# EasyEDA Pro project rtl_sdr_v1.eprj, board PCB3
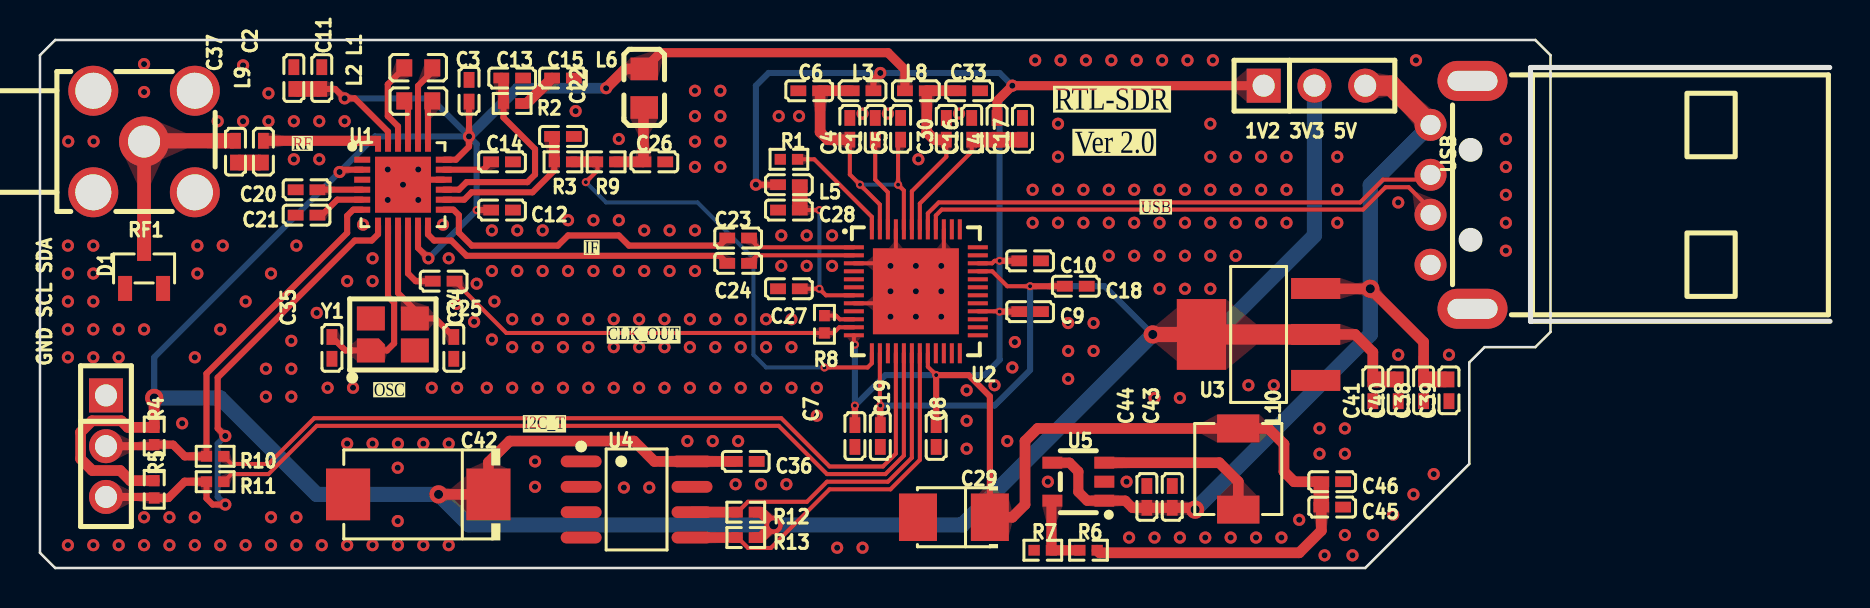
[diagram p7: board, top side]
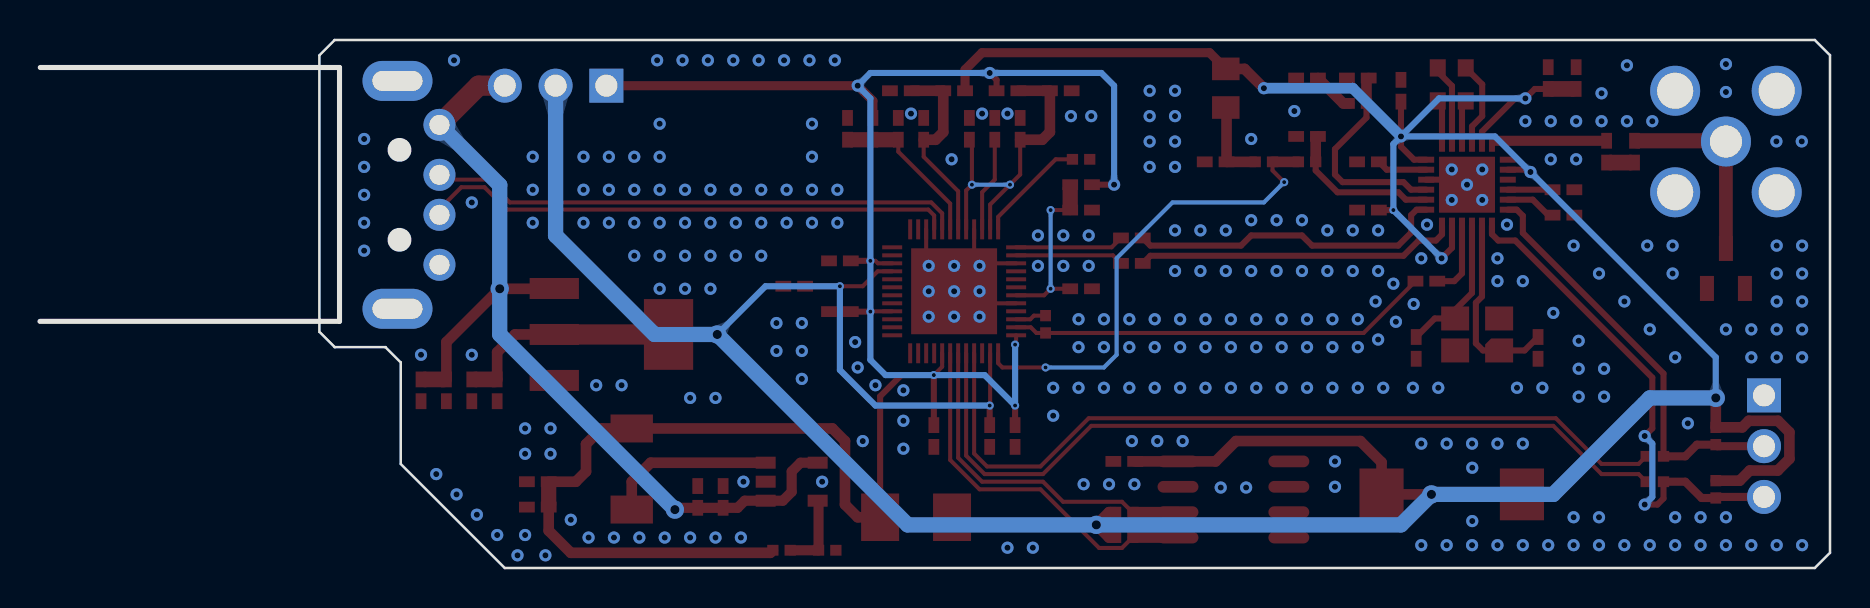
[diagram p8: board, bottom side, seen from below]

Outline 89.55 x 26.42 mm; copper layers: Top Layer, Bottom Layer. Coordinates in mm from the lower left corner of the outline.
Outline path: 0,25.65 0,0.76 0.76,0 66.29,0 71.5,5.21 71.5,10.29 72.26,11.05 74.8,11.05 75.57,11.81 75.57,25.65 74.8,26.42 0.76,26.42 0,25.65
Stack: Top Layer 0.035mm / Dielectric1 1.51mm FR4 er 4.5 / Bottom Layer 0.035mm

## Design rules (mm)
spacing safeClearance (default): track to track 0.152, other pairs 0.102 to 0.3
track width trackWidth (default): min 0.127, default 0.254, max 2.54
differential pair differentialPair (default): width min 0.127, default 0.254, max 2.54; gap min 0.152, default 0.152
via viaSize (default): diameter min 0.406, default 0.61, max 10; hole min 0.203, default 0.305, max 5.999

## Placement (name value [footprint] x y rotation side)
1V2 3V3 5V  A2541WV-3P  [HDR-TH_3P-P2.54-V-M]  63.75 24.13 0 top
C1  100nF  [C0402]  41.78 21.97 90 top
C2  100nF  [C0402]  12.7 24.51 90 top
C3  100nF  [C0402]  21.46 23.88 90 top
C4  100nF  [C0402]  40.51 21.97 270 top
C5  100nF  [C0402]  43.05 21.97 270 top
C6  2.2uF  [C0402]  38.48 23.88 0 top
C7  100nF  [C0402]  40.77 6.6 270 top
C8  100nF  [C0402]  44.83 6.6 270 top
C9  100nF  [C0402]  49.53 12.83 0 top
C10  100nF  [C0402]  49.53 15.37 0 top
C11  10nF  [C0402]  14.1 24.51 270 top
C12  10nF  [C0402]  23.11 17.91 180 top
C13  330pF  [C0402]  23.62 24.51 180 top
C14  100nF  [C0402]  23.11 20.32 180 top
C15  6.8nF  [C0402]  26.16 24.51 180 top
C16  100nF  [C0402]  46.61 21.97 270 top
C17  2.2uF  [C0402]  49.15 21.97 270 top
C18  100nF  [C0402]  51.82 14.1 0 top
C19  100nF  [C0402]  42.04 6.6 270 top
C20  1uF  [C0402]  13.33 18.92 0 top
C21  100nF  [C0402]  13.33 17.65 180 top
C22  100nF  [C0402]  26.16 21.59 0 top
C23  100nF  [C0402]  34.92 16.51 0 top
C24  100nF  [C0402]  34.92 15.24 0 top
C25  100nF  [C0402]  20.19 14.35 0 top
C26  100nF  [C0402]  30.73 20.32 180 top
C27  100nF  [C0402]  37.46 13.97 0 top
C28  2.2uF  [C0402]  37.46 17.91 0 top
C29  22uF  [CAP-SMD_L3.5-W2.8-FD]  45.72 2.54 180 top
C30  100nF  [C0402]  45.34 21.97 270 top
C33  2.2uF  [C0402]  46.48 23.88 180 top
C34  27pF  [C0402]  20.7 11.01 270 top
C35  27pF  [C0402]  14.61 11.01 90 top
C36  100nF  [C0402]  35.31 5.33 0 top
C37  10nF  [C0402]  9.78 20.83 270 top
C38  10uF  [C0402]  69.21 8.89 90 top
C39  100nF  [C0402]  70.48 8.89 90 top
C40  10uF  [C0402]  67.95 8.89 90 top
C41  100nF  [C0402]  66.67 8.89 90 top
C42  220uF  [CAP-SMD_L7.3-W4.3-R-RD]  18.92 3.68 0 top
C43  100nF  [C0402]  56.64 3.56 270 top
C44  10uF  [C0402]  55.37 3.56 270 top
C45  10uF  [C0402]  64.64 3.05 180 top
C46  100nF  [C0402]  64.64 4.32 180 top
D1  BAV99LT1G  [SOT-23-3_L2.9-W1.3-P1.90-LS2.4-BR]  5.21 14.99 270 top
GND SCL SDA  A2541WV-3P  [HDR-TH_3P-P2.54-V-M]  3.3 6.1 270 top
L1  150nH  [L0603]  18.92 25.02 0 top
L2  150nH  [L0603]  18.92 23.37 180 top
L3  26Ω@100MHz  [L0402]  41.15 23.88 0 top
L4  26Ω@100MHz  [L0402]  47.88 21.97 90 top
L5  26Ω@100MHz  [L0402]  37.46 19.18 180 top
L6  1.8uH  [L0805]  30.23 24 270 top
L8  26Ω@100MHz  [L0402]  43.82 23.88 180 top
L9  4.7nH  [L0402]  11.18 20.83 90 top
L10  2.2uH  [IND-SMD_L4.4-W4.2]  59.94 4.95 270 top
R1  10kΩ  [R0402]  37.46 20.45 0 top
R2  1.8kΩ  [R0402]  23.62 23.24 180 top
R3  10kΩ  [R0402]  26.16 20.32 0 top
R4  4.7kΩ  [R0402]  5.72 6.6 90 top
R5  4.7kΩ  [R0402]  5.72 3.94 90 top
R6  100kΩ  [R0402]  52.45 0.89 0 top
R7  100kΩ  [R0402]  50.17 0.89 0 top
R8  1MΩ  [R0402]  39.24 12.19 90 top
R9  1kΩ  [R0402]  28.32 20.32 0 top
R10  220Ω  [R0402]  8.76 5.59 0 top
R11  220Ω  [R0402]  8.76 4.32 0 top
R12  4.7kΩ  [R0402]  35.31 2.79 0 top
R13  4.7kΩ  [R0402]  35.31 1.52 0 top
RF1  DOSIN-806-0001  [CONN-TH_DOSIN-806-0001]  5.21 21.34 180 top
U1  -  [VQFN-24_L4.0-W4.0-P0.50-TL-EP2.8]  18.16 19.18 0 top
U2  -  [QFN-48_L6.0-W6.0-P0.40-BL-EP4.3]  43.82 13.84 270 top
U3  AMS1117-3.3  [SOT-223_L6.5-W3.5-P2.30-LS7.0-BR]  60.96 11.68 0 top
U4  M24C02-RMN6TP  [SOIC-8_L4.9-W3.9-P1.27-LS6.0-BL]  29.85 3.43 270 top
U5  SY8088AAC  [SOT-23-5_L3.0-W1.7-P0.95-LS2.8-BR]  51.94 4.32 0 top
USB  USB-05  [USB-A-TH_48037-0001]  70.61 18.67 90 top
Y1  -  [28.8MHz]  17.65 11.68 0 top

## Footprints (pads in the part's own frame, mm; a bottom-side part is the same pattern mirrored in y, then rotated)
28.8MHz
  custom 1.4x1.2 smd: 1(-1.1,-0.8)
  rect 1.4x1.2 smd: 2(1.1,-0.8) 3(1.1,0.8) 4(-1.1,0.8)
C0402
  rect 0.79x0.54 smd: 1(-0.545,0) 2(0.545,0)
CAP-SMD_L3.5-W2.8-FD
  rect 1.9x2.376 smd: 1(-1.798,0) 2(1.798,0)
CAP-SMD_L7.3-W4.3-R-RD
  rect 2.208x2.592 smd: 1(3.511,0) 2(-3.511,0)
CONN-TH_DOSIN-806-0001
  round 2.5 hole 1.8: 1(-2.54,-2.54) 2(-2.54,2.54) 3(2.54,2.54) 4(2.54,-2.54)
  round 2.5 hole 1.6: 5(0,0)
HDR-TH_3P-P2.54-V-M
  rect 1.7x1.7 hole 1.1: 1(-2.54,0)
  round 1.7 hole 1.1: 2(0,0) 3(2.54,0)
IND-SMD_L4.4-W4.2
  rect 1.4x2.12 smd: 1(2.028,0) 2(-2.028,0)
L0402
  rect 0.79x0.54 smd: 1(-0.545,0) 2(0.545,0)
L0603
  rect 0.8x0.864 smd: 1(-0.7,0) 2(0.7,0)
L0805
  rect 1.133x1.377 smd: 1(-0.966,0) 2(0.966,0)
QFN-48_L6.0-W6.0-P0.40-BL-EP4.3
  rect 0.2x1 smd: 1(-2.2,-3.1) 2(-1.8,-3.1) 3(-1.4,-3.1) 4(-1,-3.1) 5(-0.6,-3.1) 6(-0.2,-3.1) 7(0.2,-3.1) 8(0.6,-3.1) 9(1,-3.1) 10(1.4,-3.1) 11(1.8,-3.1) 12(2.2,-3.1) 25(2.2,3.1) 26(1.8,3.1) 27(1.4,3.1) 28(1,3.1) 29(0.6,3.1) 30(0.2,3.1) 31(-0.2,3.1) 32(-0.6,3.1) 33(-1,3.1) 34(-1.4,3.1) 35(-1.8,3.1) 36(-2.2,3.1)
  rect 1x0.2 smd: 13(3.1,-2.2) 14(3.1,-1.8) 15(3.1,-1.4) 16(3.1,-1) 17(3.1,-0.6) 18(3.1,-0.2) 19(3.1,0.2) 20(3.1,0.6) 21(3.1,1) 22(3.1,1.4) 23(3.1,1.8) 24(3.1,2.2) 37(-3.1,2.2) 38(-3.1,1.8) 39(-3.1,1.4) 40(-3.1,1) 41(-3.1,0.6) 42(-3.1,0.2) 43(-3.1,-0.2) 44(-3.1,-0.6) 45(-3.1,-1) 46(-3.1,-1.4) 47(-3.1,-1.8) 48(-3.1,-2.2)
  rect 4.3x4.3 smd: 49(-0.002,0.002)
R0402
  rect 0.566x0.54 smd: 1(-0.433,0) 2(0.433,0)
SOIC-8_L4.9-W3.9-P1.27-LS6.0-BL
  oval 0.588x2.045 smd: 1(-1.905,-2.772) 2(-0.635,-2.772) 3(0.635,-2.772) 4(1.905,-2.772) 5(1.905,2.772) 6(0.635,2.772) 7(-0.635,2.772) 8(-1.905,2.772)
SOT-23-3_L2.9-W1.3-P1.90-LS2.4-BR
  rect 1.25x0.7 smd: 1(1,-0.95) 2(1,0.95) 3(-1,0)
SOT-23-5_L3.0-W1.7-P0.95-LS2.8-BR
  rect 1x0.6 smd: 1(1.3,-0.95) 2(1.3,0) 3(1.3,0.95) 4(-1.3,0.95) 5(-1.3,-0.95)
SOT-223_L6.5-W3.5-P2.30-LS7.0-BR
  rect 2.465x1.05 smd: 1(2.857,-2.3) 2(2.857,0) 3(2.857,2.3)
  rect 2.465x3.54 smd: 4(-2.857,0)
USB-A-TH_48037-0001
  round 1.6 hole 1: 1(3.5,1.05) 2(1,1.05) 3(-1,1.05) 4(-3.5,1.05)
  oval 2x3.5 hole 1x2.5: 5(-5.7,-1.05) 6(5.7,-1.05)
VQFN-24_L4.0-W4.0-P0.50-TL-EP2.8
  rect 0.8x0.3 smd: 1(-2.042,1.25) 2(-2.042,0.75) 3(-2.042,0.25) 4(-2.042,-0.25) 5(-2.042,-0.75) 6(-2.042,-1.25) 13(2.042,-1.25) 14(2.042,-0.75) 15(2.042,-0.25) 16(2.042,0.25) 17(2.042,0.75) 18(2.042,1.25)
  rect 0.3x0.8 smd: 7(-1.25,-2.048) 8(-0.75,-2.048) 9(-0.25,-2.048) 10(0.249,-2.048) 11(0.75,-2.048) 12(1.25,-2.048) 19(1.25,2.048) 20(0.75,2.048) 21(0.249,2.048) 22(-0.25,2.048) 23(-0.75,2.048) 24(-1.25,2.048)
  rect 2.8x2.8 smd: 25(-0.001,-0.001)

## Nets
As in the schematic, except:
1V2: 1V2 3V3 5V.1 C7.1 C8.1 C9.1 C10.1 C29.1 C45.2 C46.2 L3.2 L4.2 L5.2 L10.2 R6.2 U2.12 U2.20 U2.28 U2.34
3V3: 1V2 3V3 5V.2 C2.1 C3.1 C11.2 C12.2 C18.1 C19.1 C36.1 C40.2 C41.2 C42.1 L6.1 L8.2 R4.2 R5.2 R12.2 R13.2 U1.2 U1.11 U1.18 U1.23 U2.14 U2.33 U3.2 U3.4 U4.8
5V: 1V2 3V3 5V.3 C38.2 C39.2 C43.2 C44.2 U3.3 U5.1 U5.4 USB.1
GND: C1.2 C2.2 C3.2 C4.1 C5.1 C6.1 C7.2 C8.2 C9.2 C10.2 C11.1 C12.1 C13.1 C14.1 C15.1 C16.1 C17.1 C18.2 C19.2 C20.1 C21.2 C22.2 C26.1 C27.1 C28.1 C29.2 C30.1 C33.1 C34.2 C35.1 C36.2 C38.1 C39.1 C40.1 C41.1 C42.2 C43.1 C44.1 C45.1 C46.1 D1.1 D1.2 GND SCL SDA.1 R1.1 R7.1 RF1.1 RF1.2 RF1.3 RF1.4 U1.16 U1.25 U2.3 U2.8 U2.39 U2.45 U2.49 U3.1 U4.1 U4.2 U4.3 U4.4 U4.7 U5.2 USB.4 Y1.2 Y1.4
T_SCL: GND SCL SDA.2 R4.1 R10.1 U1.6
T_SDA: GND SCL SDA.3 R5.1 R11.1 U1.7

Pads without a net: U1 1 3; U2 4 5 6 9 15 21 22 23 24 25 26 27 29 30 31 32 35 36 37 38; USB 5 6

## Via types
v1: diameter 0.61, hole 0.305, Top Layer to Bottom Layer, 295 vias
v2: diameter 0.914, hole 0.457, Top Layer to Bottom Layer, 6 vias
v3: diameter 0.406, hole 0.203, Top Layer to Bottom Layer, 14 vias

## Routing (per net, layer and track width the routed paths; a pad name or vN(x,y) marks a point on that pad's centre or on a via; arc(x,y) is an arc through that point)
1V2: length 114.8
  Top Layer w0.203: v3(48.01,15.37) 47.75,15.37 47.63,15.24 46.92,15.24 ; 44.42,10.74 44.42,10.07 v3(44.83,9.65) ; v3(40.77,11.18) 40.71,11.23 U2.12 ; U2.28 47.99,12.84 v3(48.01,12.83)
  Top Layer w0.305: L5.2 v1(35.81,19.18) ; v1(42.04,24.77) 41.69,24.42 L3.2 ; C7.1 v3(40.77,8.13) ; v3(48.01,15.37) C10.1 ; C8.1 v3(44.83,9.65) 46.45,9.65 47.52,8.59 C29.1 ; v3(48.01,12.83) C9.1
  Top Layer w0.457: L4.2 47.88,23.37 v1(48.64,24.13) 1V2 3V3 5V.1
  Top Layer w0.533: R6.2 53.01,0.76 62.99,0.76 64.1,1.87 C45.2 ; C29.1 48.64,2.54 49.28,3.17 49.28,6.35 49.91,6.98 L10.2 61.45,6.98 62.23,6.2 62.23,4.83 62.74,4.32 C46.2
  Top Layer w0.762: 64.1,3.17 64.1,4.1
  Bottom Layer w0.305: v1(35.81,19.18) 35.81,24.13 36.45,24.77 v1(42.04,24.77) 48.01,24.77 v1(48.64,24.13) 48.01,23.5 v3(48.01,15.37) v3(48.01,12.83) 48.01,10.41 47.24,9.65 v3(44.83,9.65) 42.29,9.65 v3(40.77,8.13) v3(40.77,11.18)
3V3: length 221.3
  Top Layer w0.203: 42.02,10.74 42.02,8.15 v3(42.04,8.13) ; U2.33 47.64,14.84 48.39,14.1 v3(49.53,14.1)
  Top Layer w0.305: v1(14.99,19.81) 15.1,19.93 U1.2 ; 18.91,17.13 18.91,16.01 v1(19.43,15.49) ; C3.1 v1(21.46,21.59) 21.46,21.08 20.81,20.43 U1.18 ; v3(49.53,14.1) C18.1 ; v3(42.04,8.13) C19.1 ; C11.2 14.77,23.97 v1(15.24,23.5) 15.75,23.5 17.41,21.83 U1.23 ; v3(21.84,17.91) C12.2
  Top Layer w0.457: L8.2 43.27,24.93 42.42,25.78 31.04,25.78 L6.1
  Top Layer w0.533: U3.2 65.79,11.68 66.67,10.8 C41.2 ; v2(5.72,8.51) R4.2 4.39,7.04 4.06,7.37 2.6,7.37 2.03,6.79 2.03,5.46 2.61,4.88 4.01,4.88 4.52,4.37 R5.2 ; L6.1 29.29,24.97 v1(28.32,24) ; R12.2 36.07,2.79 v2(36.7,2.16) 36.07,1.52 R13.2 ; v2(19.94,3.68) C42.1 22.43,5.29 23.5,6.35 29.72,6.35 30.73,5.33 U4.8 C36.1
  Top Layer w0.762: v2(55.67,11.68) U3.4
  Top Layer w0.787: 12.92,23.97 13.88,23.97 ; 66.8,9.44 67.73,9.44
  Top Layer w1.016: U3.2 U3.4
  Bottom Layer w0.305: v2(55.67,11.68) 53.25,14.1 v3(49.53,14.1) 49.53,9.91 47.75,8.13 v3(42.04,8.13) ; v1(19.43,15.49) v3(21.84,17.91) 21.84,21.21 v1(21.46,21.59) ; v1(21.46,21.59) 16.76,21.59 v1(14.99,19.81) 5.72,10.54 v2(5.72,8.51) ; v1(21.46,21.59) 19.56,23.5 v1(15.24,23.5)
  Bottom Layer w0.533: v1(28.32,24) 23.88,24 v1(21.46,21.59)
  Bottom Layer w0.762: 1V2 3V3 5V.2 63.75,16.64 58.8,11.68 v2(55.67,11.68) 46.14,2.16 v2(36.7,2.16) 21.46,2.16 v2(19.94,3.68) 13.84,3.68 9.02,8.51 v2(5.72,8.51)
5V: length 46.2
  Top Layer w0.508: v2(57.79,2.92) 57.7,3.01 C43.2 C44.2 54.65,3.01 54.29,3.37 U5.1 52.39,3.37 51.94,3.81 51.94,4.83 51.5,5.27 U5.4
  Top Layer w0.533: C38.2 69.21,11.3 v2(66.55,13.97) 63.83,13.97 U3.3
  Top Layer w0.787: 69.34,9.44 70.27,9.44
  Top Layer w1.016: 1V2 3V3 5V.3 67.6,24.13 USB.1
  Bottom Layer w0.762: v2(57.79,2.92) 66.55,11.68 v2(66.55,13.97) 66.55,19.16 USB.1
GND: length 9.9
  Top Layer w0.203: v1(42.55,13.84) 41.95,13.24 40.71,13.24 ; v1(45.09,15.11) 45.21,15.24 U2.39 ; U2.45 42.82,15.38 v1(42.55,15.11) 42.42,15.24 40.71,15.24
  Top Layer w0.305: U1.16 18.41,19.43 v1(18.16,19.18)
  vias: v1(1.41,21.34) v1(1.4,16.13) v1(1.4,14.73) v1(1.4,13.33) v1(1.4,11.94) v1(1.4,10.54) v1(1.4,1.14) v1(2.68,21.34) v1(2.67,16.13) v1(2.67,14.73) v1(2.67,13.33) v1(2.67,11.94) v1(2.67,10.54) v1(2.67,1.14) v1(3.94,11.94) v1(3.94,10.54) v1(3.94,1.14) v1(5.21,25.21) v1(5.21,23.81) v1(5.21,11.94) v1(5.21,2.54) v1(5.21,1.14) v1(6.48,2.54) v1(6.48,1.14) v1(7.11,7.24) v1(7.75,10.54) v1(7.75,2.54) v1(7.75,1.14) v1(7.87,16.13) v1(7.87,14.73) v1(8.89,22.35) v1(9.02,11.94) v1(9.02,1.14) v1(9.14,16.13) v1(10.16,25.15) v1(10.16,22.35) v1(10.29,13.33) v1(10.29,1.14) v1(11.3,9.97) v1(11.3,8.57) v1(11.43,23.75) v1(11.43,22.35) v1(11.56,14.73) v1(11.56,2.54) v1(11.56,1.14) v1(12.57,11.37) v1(12.57,9.97) v1(12.57,8.57) v1(12.7,22.35) v1(12.7,20.45) v1(12.83,16.13) v1(12.83,2.54) v1(12.83,1.14) v1(13.84,12.76) v1(13.97,22.35) v1(13.97,20.45) v1(14.1,1.14) v1(14.39,9.02) v1(15.24,22.35) v1(15.37,14.35) v1(15.37,6.22) v1(15.37,1.14) v1(15.66,9.02) v1(16.16,17.18) v1(16.64,15.49) v1(16.64,14.35) v1(16.64,6.22) v1(16.64,1.14) v1(17.4,19.94) v1(17.4,18.41) v1(17.91,6.22) v1(17.9,5.02) v1(17.9,2.35) v1(17.91,1.14) v1(18.92,19.94) v1(18.92,18.41) v1(19.18,6.22) v1(19.18,1.14) v1(19.6,9.02) v1(20.16,17.18) v1(20.45,15.49) v1(20.45,6.22) v1(20.45,1.14) v1(20.83,13.21) v1(20.87,9.02) v1(21.72,12.32) v1(21.84,14.22) v1(22.35,9.02) v1(22.61,16.89) v1(22.61,14.86) v1(22.61,11.43) v1(22.73,13.33) v1(23.62,12.45) v1(23.62,11.05) v1(23.62,9.02) v1(23.88,16.89) v1(23.88,14.86) v1(24.77,5.33) v1(24.77,4.06) v1(24.89,12.45) v1(24.89,11.05) v1(24.89,9.02) v1(25.15,16.89) v1(25.15,14.86) v1(26.16,12.45) v1(26.16,11.05) v1(26.16,9.02) v1(26.42,17.4) v1(26.42,14.86) v1(26.8,22.86) v1(27.43,12.45) v1(27.43,11.05) v1(27.43,9.02) v1(27.69,17.4) v1(27.69,14.86) v1(28.7,12.45) v1(28.7,11.05) v1(28.7,9.02) v1(28.96,21.46) v1(28.96,17.4) v1(28.96,14.86) v1(29.21,4.03) v1(29.97,12.45) v1(29.97,11.05) v1(29.97,9.02) v1(30.23,16.89) v1(30.23,14.86) v1(30.48,4.03) v1(31.24,12.45) v1(31.24,11.05) v1(31.24,9.02) v1(31.5,16.89) v1(31.5,14.86) v1(32.39,6.35) v1(32.51,12.45) v1(32.51,11.05) v1(32.51,9.02) v1(32.77,23.88) v1(32.77,22.61) v1(32.77,21.34) v1(32.77,20.07) v1(32.77,16.89) v1(32.77,14.86) v1(33.65,6.35) v1(33.78,12.45) v1(33.78,11.05) v1(33.78,9.02) v1(34.04,23.88) v1(34.04,22.61) v1(34.04,21.34) v1(34.04,20.07) v1(34.8,4.19) v1(34.92,6.35) v1(35.05,12.45) v1(35.05,11.05) v1(35.05,9.02) v1(36.07,4.19) v1(36.32,12.45) v1(36.32,11.05) v1(36.32,9.02) v1(36.96,22.61) v1(37.08,16.64) v1(37.08,15.11) v1(37.34,4.19) v1(37.59,12.45) v1(37.59,11.05) v1(37.59,9.02) v1(37.97,22.61) v1(38.35,16.64) v1(38.35,15.11) v1(38.86,9.02) v1(38.86,7.62) v1(39.62,16.64) v1(39.62,15.11) v1(39.88,1.02) v1(41.15,22.73) v1(41.15,1.02) v1(42.42,22.73) v1(42.55,12.57) v1(43.82,15.11) v1(43.82,13.84) v1(43.82,12.57) v1(43.94,20.45) v1(45.09,13.84) v1(45.09,12.57) v1(45.97,22.73) v1(46.36,8.89) v1(46.36,7.37) v1(46.36,5.97) v1(47.75,9.14) v1(48.39,6.35) v1(48.64,10.03) v1(48.77,11.3) v1(49.66,18.92) v1(49.66,17.27) v1(49.78,25.4) v1(50.42,4.32) v1(50.93,22.22) v1(50.93,20.57) v1(50.93,18.92) v1(50.93,17.27) v1(51.05,25.4) v1(51.43,12.26) v1(51.43,10.86) v1(51.43,9.46) v1(52.2,18.92) v1(52.2,17.27) v1(52.32,25.4) v1(52.7,12.26) v1(52.7,10.86) v1(53.47,18.92) v1(53.47,17.27) v1(53.47,15.62) v1(53.59,25.4) v1(54.36,4.32) v1(54.48,1.52) v1(54.74,18.92) v1(54.74,17.27) v1(54.74,15.62) v1(54.86,25.4) v1(55.75,8.51) v1(55.75,1.52) v1(56.01,18.92) v1(56.01,17.27) v1(56.01,15.62) v1(56.01,13.97) v1(56.13,25.4) v1(57.02,8.51) v1(57.02,1.52) v1(57.28,18.92) v1(57.28,17.27) v1(57.28,15.62) v1(57.28,13.97) v1(57.4,25.4) v1(58.29,1.52) v1(58.55,22.22) v1(58.55,20.57) v1(58.55,18.92) v1(58.55,17.27) v1(58.55,15.62) v1(58.55,13.97) v1(58.67,25.4) v1(59.56,1.52) v1(59.82,20.57) v1(59.82,18.92) v1(59.82,17.27) v1(59.82,15.62) v1(60.45,9.14) v1(60.83,1.52) v1(61.09,20.57) v1(61.09,18.92) v1(61.09,17.27) v1(61.72,9.14) v1(62.1,1.52) v1(62.36,20.57) v1(62.36,18.92) v1(62.36,17.27) v1(62.99,2.41) v1(64.01,6.98) v1(64.01,5.72) v1(64.26,0.64) v1(64.9,20.57) v1(64.9,18.92) v1(64.9,17.27) v1(65.28,6.98) v1(65.28,5.72) v1(65.28,1.65) v1(65.66,0.64) v1(66.67,1.65) v1(67.69,2.67) v1(67.95,18.29) v1(67.95,10.67) v1(68.71,3.68) v1(68.83,25.4) v1(69.72,4.7) v1(70.48,10.67) v1(73.33,21.46) v1(73.33,20.07) v1(73.33,18.67) v1(73.33,17.27) v1(73.33,15.88)
VDD_PLL: length 8.7
  Top Layer w0.203: 38.01,17.91 v3(38.99,17.91) ; U2.7 39.32,13.64 v3(38.99,13.97) 38.01,13.97
  Top Layer w0.762: 38.01,18.03 38.01,18.96
  Bottom Layer w0.203: v3(38.99,17.91) v3(38.99,13.97)
VDDA12: length 17
  Top Layer w0.203: C4.2 40.51,19.69 v3(41.02,19.18) 42.02,18.18 U2.47 ; U2.44 43.21,18.89 v3(42.93,19.18) 42.93,21.3 C5.2
  Top Layer w0.533: L3.1 C6.2 39.03,21.81 39.41,21.43 C4.2
  Bottom Layer w0.203: v3(41.02,19.18) v3(42.93,19.18)
VDDA33: length 10
  Top Layer w0.203: U2.43 43.61,18.85 45.34,20.57 C30.2
  Top Layer w0.533: C30.2 44.74,21.43 44.36,21.81 L8.1 C33.2
CLK_OUT: length 21.2
  Top Layer w0.203: 40.71,12.04 39.98,12.04 39.7,11.76 R8.1 23.33,11.76 C25.2
IF_AGC: length 24.1
  Top Layer w0.203: 27.89,20.32 27.89,19.89 v3(27.3,19.3) ; 41.61,10.74 41.61,10.25 41.4,10.03 v3(39.24,10.03)
  Top Layer w0.533: R3.2 27.89,20.32
  Bottom Layer w0.203: v3(27.3,19.3) 28.32,18.29 32.89,18.29 35.69,15.49 35.69,10.67 36.32,10.03 v3(39.24,10.03)
IF_IN: length 5.4
  Top Layer w0.203: U2.2 35.87,15.64 35.47,15.24
IF_IP: length 5.4
  Top Layer w0.203: 35.47,16.51 35.94,16.04 40.71,16.04
RF_IN: length 5.6
  Top Layer w0.508: L9.2 16.73,21.37
ROM_SCL: length 17.3
  Top Layer w0.203: 34.9,2.79 35.42,3.31 38.37,3.31 39.37,4.32 42.42,4.32 43.61,5.52 43.61,10.74
  Top Layer w0.533: R12.1 U4.6
ROM_SDA: length 18.7
  Top Layer w0.203: 44.01,10.74 44.01,5.41 42.55,3.94 39.5,3.94 36.56,1 35.42,1 34.9,1.52
  Top Layer w0.533: R13.1 U4.5
T_SCL: length 21.1
  Top Layer w0.305: R10.1 8.33,9.73 15.37,16.76 15.37,17.62 15.67,17.93 U1.6
  Top Layer w0.406: R10.1 7.24,5.59 6.66,6.17 R4.1 5.64,6.1 GND SCL SDA.2
T_SDA: length 25.5
  Top Layer w0.305: 16.91,17.13 16.91,16.7 16.6,16.38 15.75,16.38 8.89,9.53 8.89,6.98 v1(9.27,6.6) ; R11.1 8.33,3.48 8.64,3.17 v1(9.27,3.17)
  Top Layer w0.406: GND SCL SDA.3 5.66,3.56 R5.1 6.42,3.5 7.24,4.32 R11.1
  Bottom Layer w0.305: v1(9.27,3.17) 8.89,3.56 8.89,6.22 v1(9.27,6.6)
USB_DM: length 26.7
  Top Layer w0.203: U2.41 44.42,17.75 44.96,18.29 66.04,18.29 67.18,19.43 69.32,19.43 USB.2
USB_DP: length 26.8
  Top Layer w0.203: U2.40 44.81,17.64 45.11,17.93 66.19,17.93 67.31,19.05 68.47,19.05 69.56,17.96 USB.3
UVDDA: length 7.2
  Top Layer w0.203: C16.2 46.61,20.83 44.01,18.23 U2.42
  Top Layer w0.762: 48.13,21.43 48.93,21.43 ; 46.86,21.43 47.66,21.43
XTAL_I: length 9.6
  Top Layer w0.305: 17.41,17.13 17.41,13.58 17.72,13.27 17.72,11.24 17.36,10.88 Y1.1 15.28,10.88 C35.2
XTAL_O: length 7.3
  Top Layer w0.305: C34.1 19.77,12.48 Y1.3 18.75,12.91 17.91,13.76 17.91,17.13
$1N1594: length 9.8
  Top Layer w0.686: RF1.5 D1.3
  Top Layer w0.762: 9.61,21.37 5.24,21.37 RF1.5
$1N1930: length 1
  Top Layer w0.787: 10,20.28 10.96,20.28
$1N6838: length 2.6
  Top Layer w0.305: C21.1 14.1,17.65 14.87,18.43 U1.5
$1N6851: length 2.2
  Top Layer w0.305: C20.2 13.88,18.93 U1.4
$1N11372: length 4.3
  Top Layer w0.305: U1.22 17.91,22.09 17.4,22.61 17.4,24.19 L1.1
$1N11392: length 4.1
  Top Layer w0.305: U1.20 18.91,24.12 19.62,24.83 L1.2
$1N12305: length 2.2
  Top Layer w0.305: L2.1 19.41,23.16 U1.19
$1N12306: length 2.2
  Top Layer w0.305: L2.2 18.41,23.18 U1.21
$1N15211: length 16
  Top Layer w0.305: U1.13 20.68,17.93 20.95,17.65 20.95,16.78 21.6,16.13 25.91,16.13 26.42,16.64 28.96,16.64 29.46,16.13 34,16.13 C23.1
$1N15347: length 16
  Top Layer w0.305: C24.1 34,15.62 21.34,15.62 20.57,16.38 19.72,16.38 19.41,16.69 19.41,17.13
$1N15700: length 7.9
  Top Layer w0.305: R3.1 25.73,19.89 24.64,18.8 21.59,18.8 21.22,18.43 U1.14
  Top Layer w0.533: C22.1 25.73,21.48 R3.1
$1N16619: length 10.4
  Top Layer w0.305: R2.2 23.19,22.53 24.77,20.95 24.77,19.69 24.38,19.3 21.34,19.3 20.96,18.93 U1.15
  Top Layer w0.533: C13.2 23.19,24.4 R2.2
$1N16902: length 2.5
  Top Layer w0.305: C14.2 22.18,19.93 U1.17
$1N17181: length 2.1
  Top Layer w0.533: C15.2 24.35,23.24 R2.1
$1N21853: length 3.8
  Top Layer w0.305: 18.41,17.13 18.41,14.74 18.8,14.35 C25.1
$1N26222: length 1.5
  Top Layer w0.203: U2.10 40.01,12.44 39.83,12.62 R8.2
$1N27944: length 41
  Top Layer w0.203: 42.82,10.74 42.82,5.73 42.17,5.08 39.5,5.08 37.08,7.49 13.72,7.49 11.43,5.21 9.58,5.21 9.2,5.59
$1N27983: length 41.7
  Top Layer w0.203: 9.2,4.32 9.58,4.7 11.43,4.7 13.84,7.11 36.96,7.11 39.37,4.7 42.29,4.7 43.21,5.62 43.21,10.74
$1N40591: length 5.5
  Top Layer w0.203: U2.48 41.61,17.57 38.73,20.45 37.9,20.45
$1N40849: length 4.7
  Top Layer w0.203: C1.1 41.78,19.43 42.42,18.8 U2.46
$1N44263: length 4.2
  Top Layer w0.533: R9.2 C26.2 30.19,23.04 L6.2
$1N111728: length 8.5
  Top Layer w0.533: U5.3 58.99,5.27 59.94,4.32 L10.1
$1N117586: length 3.9
  Top Layer w0.508: U5.5 50.6,3.32 R7.2 R6.1

## Copper pours and planes (outline as drawn; the poured copper is in the pictures)
GND on Top Layer: -0.13,26.54 75.69,26.54 75.69,-0.13 -0.13,-0.13
GND on Bottom Layer: -0.13,26.54 75.69,26.54 75.69,-0.13 -0.13,-0.13

Small or netless copper shapes (teardrops, artwork), in the pictures only: 187 on Top Layer, 28 on Bottom Layer

## Text on the board
Top Silkscreen Layer: RF | OSC | I2C_T | IF | CLK_OUT | USB | RTL-SDR | Ver 2.0
